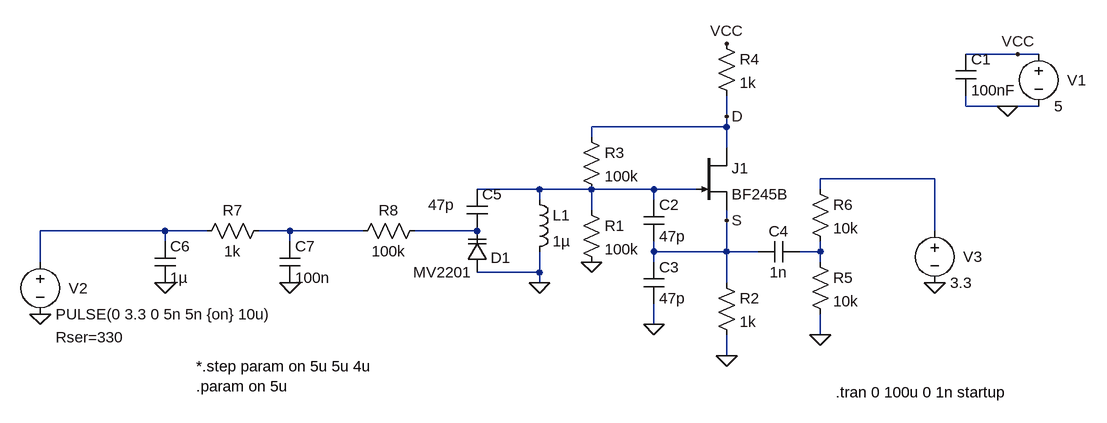
[diagram p0: schematic BF245B-Colpitz-Tunable.asc]
BF245B-Colpitz-Tunable.asc, the LTspice schematic file:
Version 4
SHEET 1 880 680
WIRE 192 -80 112 -80
WIRE 224 -80 192 -80
WIRE 112 0 112 -16
WIRE 176 0 112 0
WIRE 224 0 176 0
WIRE -256 16 -256 -16
WIRE -256 32 -256 16
WIRE -256 32 -464 32
WIRE -464 48 -464 32
WIRE -256 64 -256 32
WIRE 64 112 -112 112
WIRE -544 128 -640 128
WIRE -464 128 -544 128
WIRE -368 128 -464 128
WIRE -304 128 -368 128
WIRE -112 128 -112 112
WIRE -544 144 -544 128
WIRE -368 144 -368 128
WIRE -464 160 -464 128
WIRE -256 176 -256 160
WIRE -1120 192 -1312 192
WIRE -1056 192 -1120 192
WIRE -928 192 -976 192
WIRE -816 192 -928 192
WIRE -640 192 -736 192
WIRE 64 192 64 112
WIRE -1120 208 -1120 192
WIRE -928 208 -928 192
WIRE -368 224 -368 208
WIRE -256 224 -256 176
WIRE -256 224 -368 224
WIRE -208 224 -256 224
WIRE -112 224 -112 208
WIRE -112 224 -144 224
WIRE -1312 240 -1312 192
WIRE -368 240 -368 224
WIRE -112 240 -112 224
WIRE -544 256 -544 224
WIRE -544 256 -640 256
WIRE -544 272 -544 256
WIRE -256 272 -256 224
WIRE -368 336 -368 304
WIRE -112 352 -112 320
WIRE -256 384 -256 352
FLAG 176 0 0
FLAG 192 -80 VCC
FLAG -256 176 S
FLAG -256 16 D
FLAG -256 384 0
FLAG -256 -96 VCC
FLAG -368 336 0
FLAG -464 240 0
FLAG -544 272 0
FLAG -1312 320 0
FLAG -112 352 0
FLAG 64 272 0
FLAG -1120 272 0
FLAG -928 272 0
SYMBOL voltage 224 -96 R0
WINDOW 123 0 0 Left 0
WINDOW 39 0 0 Left 0
WINDOW 0 44 56 Left 0
SYMATTR InstName V1
SYMATTR Value 5
SYMBOL njf -304 64 R0
SYMATTR InstName J1
SYMATTR Value BF245B
SYMBOL res -272 256 R0
SYMATTR InstName R2
SYMATTR Value 1k
SYMBOL cap 96 -80 R0
SYMATTR InstName C1
SYMATTR Value 100nF
SYMBOL cap -384 144 R0
SYMATTR InstName C2
SYMATTR Value 47p
SYMBOL cap -384 240 R0
SYMATTR InstName C3
SYMATTR Value 47p
SYMBOL ind -560 128 R0
SYMATTR InstName L1
SYMATTR Value 1µ
SYMBOL res -480 144 R0
SYMATTR InstName R1
SYMATTR Value 100k
SYMBOL res -480 32 R0
SYMATTR InstName R3
SYMATTR Value 100k
SYMBOL res -272 -112 R0
SYMATTR InstName R4
SYMATTR Value 1k
SYMBOL cap -656 128 R0
WINDOW 3 -59 24 Left 0
SYMATTR InstName C5
SYMATTR Value 47p
SYMBOL varactor -624 256 R180
WINDOW 0 -36 23 Left 0
WINDOW 3 24 0 Left 0
SYMATTR InstName D1
SYMATTR Value MV2201
SYMATTR Type diode
SYMBOL voltage -1312 224 R0
WINDOW 123 0 0 Left 0
WINDOW 39 24 132 Left 0
WINDOW 0 44 56 Left 0
SYMATTR SpiceLine Rser=330
SYMATTR InstName V2
SYMATTR Value PULSE(0 3.3 0 5n 5n {on} 10u)
SYMBOL cap -144 208 R90
WINDOW 0 0 32 VBottom 0
WINDOW 3 32 32 VTop 0
SYMATTR InstName C4
SYMATTR Value 1n
SYMBOL res -128 224 R0
SYMATTR InstName R5
SYMATTR Value 10k
SYMBOL res -128 112 R0
SYMATTR InstName R6
SYMATTR Value 10k
SYMBOL voltage 64 176 R0
WINDOW 123 0 0 Left 0
WINDOW 39 0 0 Left 0
WINDOW 0 44 56 Left 0
SYMATTR InstName V3
SYMATTR Value 3.3
SYMBOL cap -1136 208 R0
SYMATTR InstName C6
SYMATTR Value 1µ
SYMBOL res -960 176 R90
WINDOW 0 0 56 VBottom 0
WINDOW 3 32 56 VTop 0
SYMATTR InstName R7
SYMATTR Value 1k
SYMBOL cap -944 208 R0
SYMATTR InstName C7
SYMATTR Value 100n
SYMBOL res -720 176 R90
WINDOW 0 0 56 VBottom 0
WINDOW 3 32 56 VTop 0
SYMATTR InstName R8
SYMATTR Value 100k
TEXT -88 440 Left 0 !.tran 0 100u 0 1n startup
TEXT -1072 400 Left 0 !*.step param on 5u 5u 4u\n.param on 5u

The netlist it stands for:
* BF245B-Colpitz-Tunable.asc
V1 VCC 0 5
J1 D N002 S BF245B
R2 S 0 1k
C1 VCC 0 100nF
C2 N002 S 47p
C3 S 0 47p
L1 N002 0 1µ
R1 N002 0 100k
R3 D N002 100k
R4 VCC D 1k
C5 N002 N005 47p
D1 0 N005 MV2201
V2 N003 0 PULSE(0 3.3 0 5n 5n {on} 10u) Rser=330
C4 N006 S 1n
R5 N006 0 10k
R6 N001 N006 10k
V3 N001 0 3.3
C6 N003 0 1µ
R7 N004 N003 1k
C7 N004 0 100n
R8 N005 N004 100k
.model D D
.lib standard.dio
.model NJF NJF
.model PJF PJF
.lib standard.jft
.tran 0 100u 0 1n startup
*.step param on 5u 5u 4u
.param on 5u
.backanno
.end